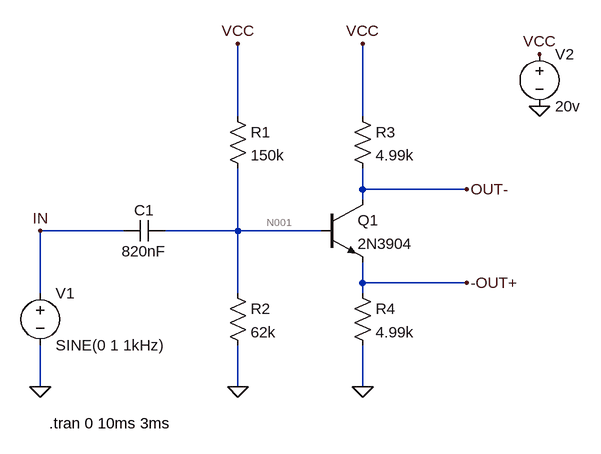
[diagram p0: schematic Unity-Gain Phase-Splitter.asc]
Unity-Gain Phase-Splitter.asc, the LTspice schematic file:
Version 4
SHEET 1 1032 680
WIRE 384 -96 384 -208
WIRE 576 -96 576 -208
WIRE 576 16 576 -16
WIRE 736 16 576 16
WIRE 576 32 576 16
WIRE 208 80 80 80
WIRE 384 80 384 -16
WIRE 384 80 272 80
WIRE 512 80 384 80
WIRE 576 160 576 128
WIRE 736 160 576 160
WIRE 80 176 80 80
WIRE 384 176 384 80
WIRE 576 176 576 160
WIRE 80 320 80 256
WIRE 384 320 384 256
WIRE 576 320 576 256
FLAG 80 320 0
FLAG 384 320 0
FLAG 576 320 0
FLAG 384 -208 VCC
FLAG 576 -208 VCC
FLAG 848 -192 VCC
FLAG 848 -112 0
FLAG 736 16 OUT-
FLAG 736 160 -OUT+
FLAG 80 80 IN
SYMBOL voltage 80 160 R0
WINDOW 123 0 0 Left 0
WINDOW 39 0 0 Left 0
SYMATTR InstName V1
SYMATTR Value SINE(0 1 1kHz)
SYMBOL cap 272 64 R90
WINDOW 0 0 32 VBottom 2
WINDOW 3 32 32 VTop 2
SYMATTR InstName C1
SYMATTR Value 820nF
SYMBOL res 368 -112 R0
SYMATTR InstName R1
SYMATTR Value 150k
SYMATTR SpiceLine tol=5
SYMBOL res 368 160 R0
SYMATTR InstName R2
SYMATTR Value 62k
SYMATTR SpiceLine tol=5
SYMBOL res 560 -112 R0
SYMATTR InstName R3
SYMATTR Value 4.99k
SYMATTR SpiceLine tol=1
SYMBOL res 560 160 R0
SYMATTR InstName R4
SYMATTR Value 4.99k
SYMATTR SpiceLine tol=1
SYMBOL npn 512 32 R0
SYMATTR InstName Q1
SYMATTR Value 2N3904
SYMBOL voltage 848 -208 R0
WINDOW 123 0 0 Left 0
WINDOW 39 0 0 Left 0
SYMATTR InstName V2
SYMATTR Value 20v
TEXT 94 376 Left 2 !.tran 0 10ms 3ms

The netlist it stands for:
* Unity-Gain Phase-Splitter.asc
V1 IN 0 SINE(0 1 1kHz)
C1 N001 IN 820nF
R1 VCC N001 150k tol=5
R2 N001 0 62k tol=5
R3 VCC OUT- 4.99k tol=1
R4 -OUT+ 0 4.99k tol=1
Q1 OUT- N001 -OUT+ 0 2N3904
V2 VCC 0 20v
.model NPN NPN
.model PNP PNP
.lib standard.bjt
.tran 0 10ms 3ms
.backanno
.end

* Results of the author's LTspice run, read from the files saved beside the schematic
* Operating Point, zero values left out:
*   V(n001) = 5.713 V
*   V(vcc) = 20 V
*   V(out-) = 14.96 V
*   V(-out+) = 5.06 V
*   Ic(Q1) = 1.011 mA
*   Ib(Q1) = 3.092 µA
*   Ie(Q1) = -1.014 mA
*   I(R4) = 1.014 mA
*   I(R3) = 1.011 mA
*   I(R2) = 92.15 µA
*   I(R1) = 95.24 µA
*   I(V2) = -1.106 mA
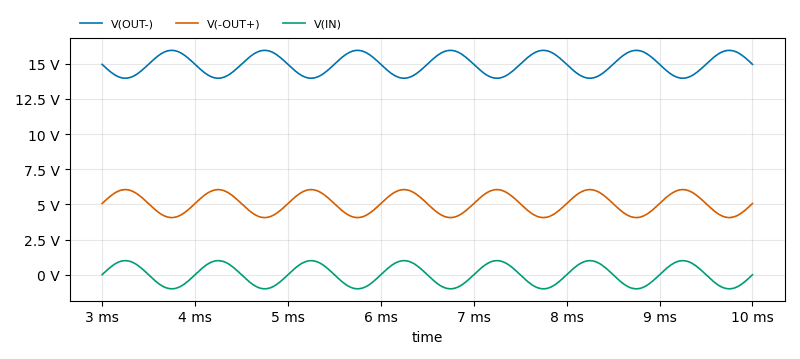
[diagram p1: Transient Analysis of Unity-Gain Phase-Splitter.asc, plotted from the saved traces]
* Transient Analysis, 1 run:
*   V(OUT-): min 13.97 V, max 15.95 V, average 14.96 V, rms 14.98 V, last 14.95 V
*   V(-OUT+): min 4.063 V, max 6.05 V, average 5.057 V, rms 5.105 V, last 5.061 V
*   V(IN): min -1 V, max 1 V, average 0 V, rms 707.2 mV, last 0 V